# Altium schematic sheet TOP.SchDoc
size B; Author: E. Sims; Organization: Let's Build Rockets Inc.; SheetNumber: 1; SheetTotal: 16
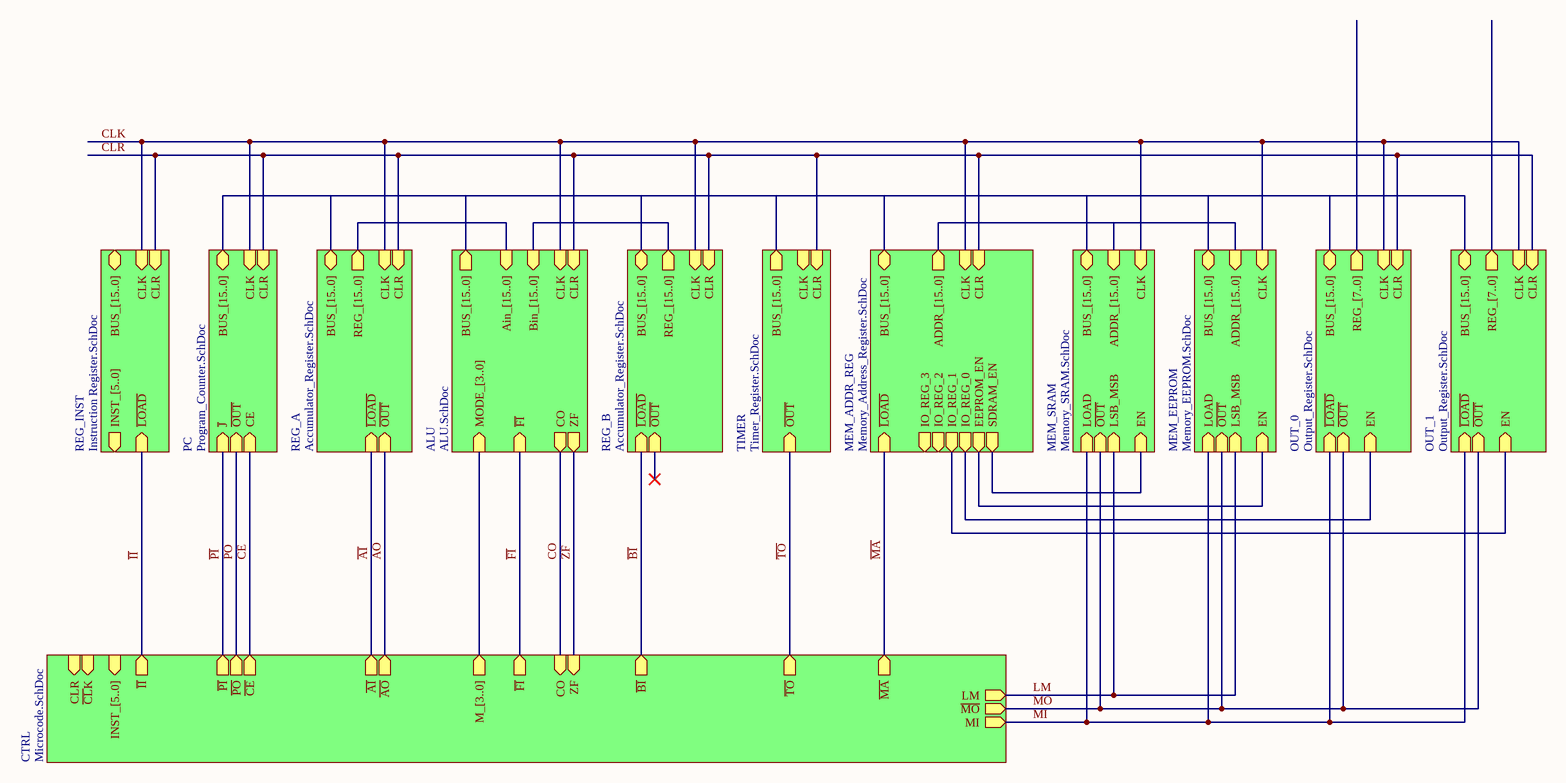
[diagram p0: TOP.SchDoc]

## Sub-sheets
ALU = ALU.SchDoc: MODE_[3..0] (in), BUS_[15..0] (out), Ain_[15..0] (in), Bin_[15..0] (in), CO (out), CLK (in), ~{FI} (in), ZF (out), CLR (in)
CTRL = Microcode.SchDoc: ~{AO} (out), ~{CE} (out), MI (out), ~{MA} (out), ~{FI} (out), ~{PI} (out), ~{AI} (out), ~{II} (out), CLR (in), ~{PO} (out), LM (out), ~{MO} (out), ~{TO} (out), INST_[5..0] (in), ~{CL}K (in), ~{BI} (out), M_[3..0] (out), ZF (in), CO (in)
MEM_ADDR_REG = Memory_Address_Register.SchDoc: CLK (in), CLR (in), ~{LOAD} (in), BUS_[15..0] (bidir), ADDR_[15..0] (out), EEPROM_EN (out), SDRAM_EN (out), IO_REG_2 (out), IO_REG_3 (out), IO_REG_1 (out), IO_REG_0 (out)
MEM_EEPROM = Memory_EEPROM.SchDoc: CLK (in), BUS_[15..0] (bidir), ADDR_[15..0] (in), LOAD (in), LSB_MSB (in), ~{OUT} (in), EN (in)
MEM_SRAM = Memory_SRAM.SchDoc: CLK (in), BUS_[15..0] (bidir), ADDR_[15..0] (in), LOAD (in), LSB_MSB (in), ~{OUT} (in), EN (in)
OUT_0 = Output_Register.SchDoc: ~{LOAD} (in), CLR (in), BUS_[15..0] (bidir), ~{OUT} (in), CLK (in), REG_[7..0] (out), EN (in)
OUT_1 = Output_Register.SchDoc: ~{LOAD} (in), CLR (in), BUS_[15..0] (bidir), ~{OUT} (in), CLK (in), REG_[7..0] (out), EN (in)
PC = Program_Counter.SchDoc: CLK (in), ~{OUT} (in), CLR (in), BUS_[15..0] (bidir), CE (in), ~{J} (in)
REG_A = Accumulator_Register.SchDoc: CLK (in), ~{OUT} (in), CLR (in), ~{LOAD} (in), BUS_[15..0] (bidir), REG_[15..0] (out)
REG_B = Accumulator_Register.SchDoc: CLK (in), ~{OUT} (in), CLR (in), ~{LOAD} (in), BUS_[15..0] (bidir), REG_[15..0] (out)
REG_INST = Instruction Register.SchDoc: CLK (in), CLR (in), BUS_[15..0] (bidir), ~{LOAD} (in), INST_[5..0] (out)
TIMER = Timer_Register.SchDoc: CLK (in), ~{OUT} (in), CLR (in), BUS_[15..0] (out)

## Nets
~{AI}: sheet REG_A/~{LOAD}, sheet CTRL/~{AI}
~{AO}: sheet REG_A/~{OUT}, sheet CTRL/~{AO}
~{BI}: sheet REG_B/~{LOAD}, sheet CTRL/~{BI}
~{CE}: sheet PC/CE, sheet CTRL/~{CE}
CLK: sheet REG_A/CLK, sheet REG_B/CLK, sheet PC/CLK, sheet MEM_ADDR_REG/CLK, sheet MEM_SRAM/CLK, sheet MEM_EEPROM/CLK, sheet ALU/CLK, sheet OUT_0/CLK, sheet REG_INST/CLK, sheet OUT_1/CLK
CLR: sheet REG_A/CLR, sheet REG_B/CLR, sheet PC/CLR, sheet MEM_ADDR_REG/CLR, sheet ALU/CLR, sheet OUT_0/CLR, sheet REG_INST/CLR, sheet TIMER/CLR, sheet OUT_1/CLR
CO: sheet ALU/CO, sheet CTRL/CO
~{FI}: sheet ALU/~{FI}, sheet CTRL/~{FI}
~{II}: sheet REG_INST/~{LOAD}, sheet CTRL/~{II}
LM: sheet MEM_SRAM/LSB_MSB, sheet MEM_EEPROM/LSB_MSB, sheet CTRL/LM
~{MA}: sheet MEM_ADDR_REG/~{LOAD}, sheet CTRL/~{MA}
~{MO}: sheet MEM_SRAM/~{OUT}, sheet MEM_EEPROM/~{OUT}, sheet OUT_0/~{OUT}, sheet CTRL/~{MO}, sheet OUT_1/~{OUT}
MI: sheet MEM_SRAM/LOAD, sheet MEM_EEPROM/LOAD, sheet OUT_0/~{LOAD}, sheet CTRL/MI, sheet OUT_1/~{LOAD}
~{PI}: sheet PC/~{J}, sheet CTRL/~{PI}
~{PO}: sheet PC/~{OUT}, sheet CTRL/~{PO}
~{TO}: sheet CTRL/~{TO}, sheet TIMER/~{OUT}
ZF: sheet ALU/ZF, sheet CTRL/ZF
(unnamed): sheet MEM_ADDR_REG/EEPROM_EN, sheet MEM_EEPROM/EN
(unnamed): sheet MEM_ADDR_REG/SDRAM_EN, sheet MEM_SRAM/EN
(unnamed): sheet MEM_ADDR_REG/IO_REG_1, sheet OUT_1/EN
(unnamed): sheet MEM_ADDR_REG/IO_REG_0, sheet OUT_0/EN

## Buses and harness runs
bus sheet ALU/Ain_[15..0] = sheet REG_A/REG_[15..0]
bus sheet ALU/Bin_[15..0] = sheet REG_B/REG_[15..0]
bus sheet ALU/BUS_[15..0] = sheet MEM_ADDR_REG/BUS_[15..0] = sheet MEM_EEPROM/BUS_[15..0] = sheet MEM_SRAM/BUS_[15..0] = sheet OUT_0/BUS_[15..0] = sheet OUT_1/BUS_[15..0] = sheet PC/BUS_[15..0] = sheet REG_A/BUS_[15..0] = sheet REG_B/BUS_[15..0] = sheet TIMER/BUS_[15..0]
bus sheet ALU/MODE_[3..0] = sheet CTRL/M_[3..0]
bus sheet MEM_ADDR_REG/ADDR_[15..0] = sheet MEM_EEPROM/ADDR_[15..0] = sheet MEM_SRAM/ADDR_[15..0]

## Notes on the sheet
- Let's Build Rocket's Inc. Modular Paylaod System Based on TMP-010 Rev
  For more information visit https://github.com/LetsBuildRockets/Modular-Payload-System
  This work is licensed under CC BY-NC 4.0. To view a copy of this license, visit https://creativecommons.org/licenses/by-nc/4.0
- Title
- Size:
- Date:
- Assembly Variant:
- B
- Number:
- Time:
- Revision:
- Sheet
- of
- Author:
- File: